# EasyEDA schematic 4 HF Upconverter (SMD)_ Power circuit.json
TITLE: HF Upconverter (SMD): Power circuit; REV: 8.14.EE; Date: 2018-03-02; Sheet: 1/1; Drawn By: IgrikXD
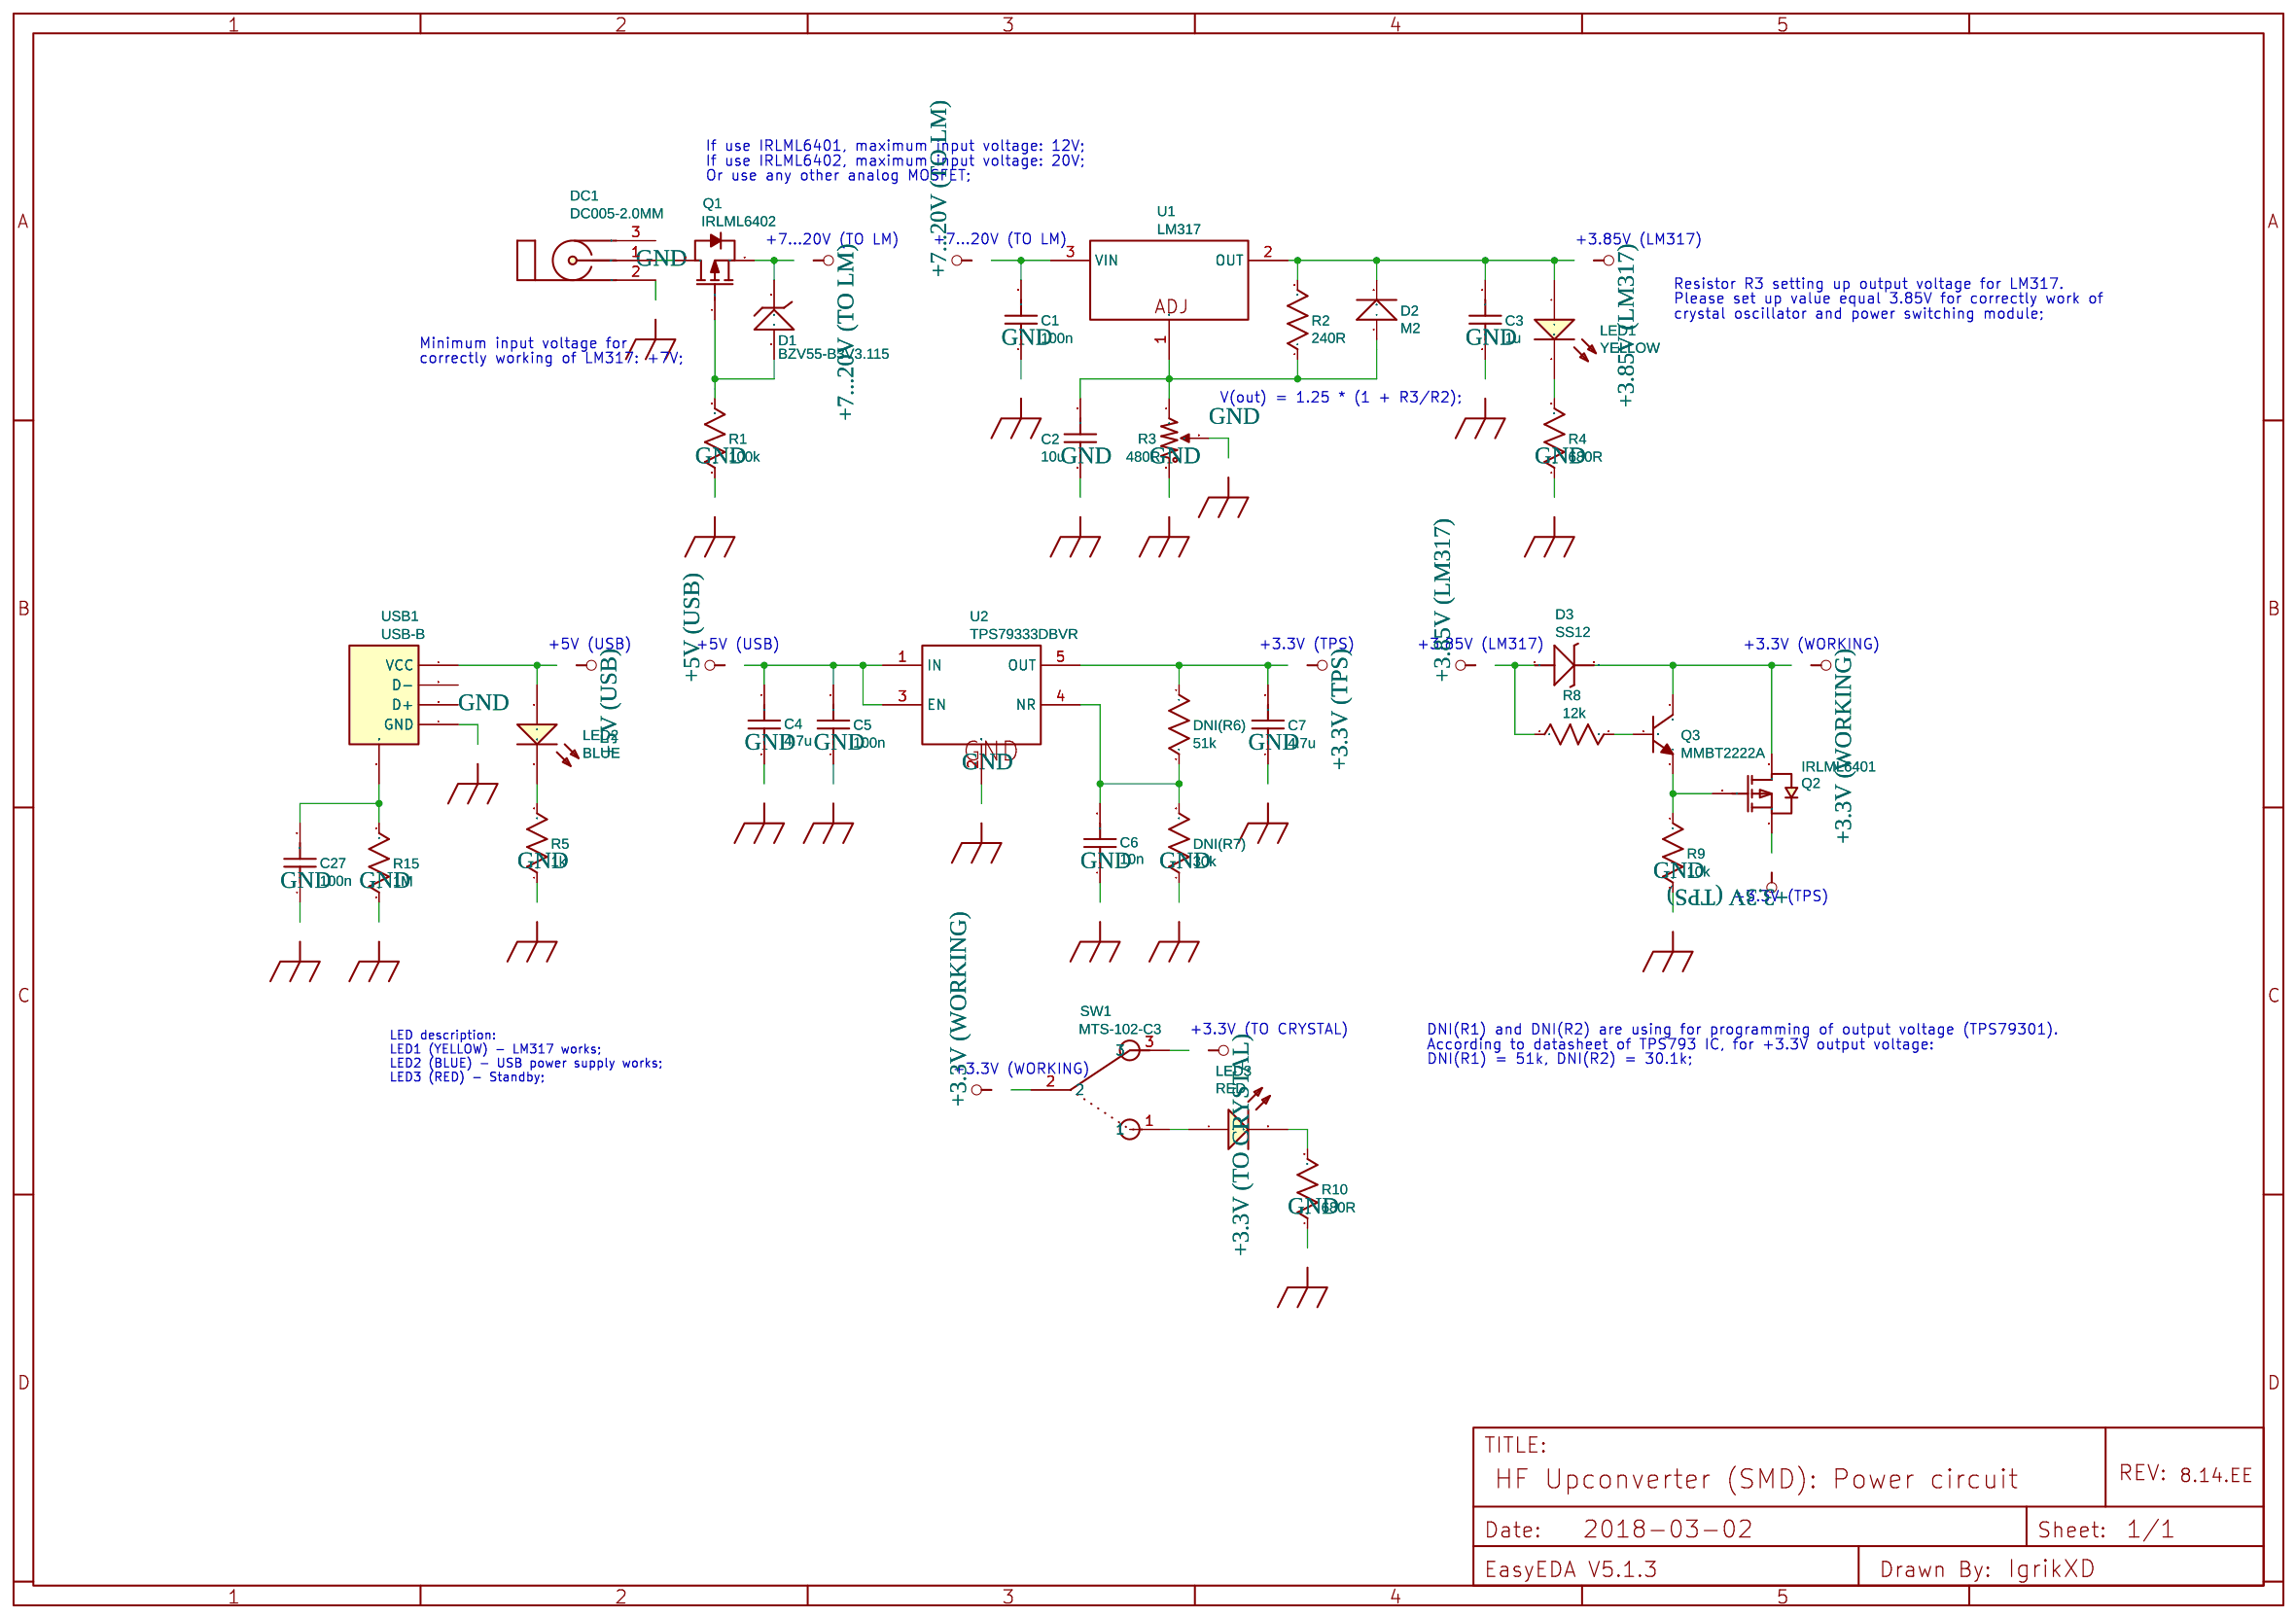
[diagram p0: schematic sheet]

## Parts
C1  100n  [0805]
C2  10u  [0805]
C3  1u  [0805]
C4  4.7u  [0805]
C5  100n  [0805]
C6  10n  [0805]
C7  4.7u  [0805]
C27  100n  [0805]
D1  BZV55-B3V3.115  [DO-213AC]
D2  M2  [DO214AC]
D3  SS12  [DO214AC]
DC1  DC005-2.0MM  [DC-5020]
DNI(R6)  51k  [0805]
DNI(R7)  30k  [0805]
LED1  YELLOW  [LED-0805]
LED2  BLUE  [LED-0805]
LED3  RED  [LED-0805]
Q1  IRLML6402  [SOT-23(SOT-23-3)]
Q2  IRLML6401  [SOT-23(SOT-23-3)]
Q3  MMBT2222A  [SOT-23(SOT-23-3)]
R1  100k  [0805]
R2  240R  [0805]
R3  480R  [RES-ADJ_3296W]
R4  680R  [0805]
R5  1k  [0805]
R8  12k  [0805]
R9  10k  [0805]
R10  680R  [0805]
R15  1M  [0805]
SW1  MTS-102-C3  [MTS-102-C3]
U1  LM317  [TO-252-2]
U2  TPS79333DBVR  [SOT23-5]
USB1  USB-B  [USB TYPE B]

## Library data of the parts
C1 C5 C27 = Capacitor: Manufacturer Part: 08055C104JAT2A; Supplier: LCSC; LCSC: C129175; Manufacturer: AVX
C2 = Capacitor: Manufacturer Part: GRM21BR71A106KE51L; Supplier: LCSC; LCSC: C86038; Manufacturer: MuRata
C3 = Capacitor: Manufacturer Part: CL21B105KAFNFNE; Supplier: LCSC; LCSC: C1712; Manufacturer: SAMSUNG
C4 C7 = Capacitor: Manufacturer Part: 0805X475K250NT; Supplier: LCSC; LCSC: C67142; Manufacturer: FH
C6 = Capacitor: Manufacturer Part: 0805CG103J500NT; Supplier: LCSC; LCSC: C63849; Manufacturer: FH
D1 = -: catid: 20; Manufacturer Part: BZV55-C3V3,115; Supplier: LCSC; LCSC: C128828; Manufacturer: Nexperia
D2 = -: catid: 20; Manufacturer Part: M2 GPP; Supplier: LCSC; LCSC: C123826; Manufacturer: MDD
D3 = -: catid: 20; Contributor: SparkFun; Manufacturer Part: SS12-LTP; Supplier: LCSC; LCSC: C85684; Manufacturer: MCC
DC1 = -: Supplier: LCSC; Manufacturer: BOOMELE; Manufacturer Part: DC-005 5.5-2.0MM; LCSC: C16214
DNI(R6) = Resistor: Manufacturer Part: RTT055102FTP; Supplier: LCSC; LCSC: C104376; Manufacturer: RALEC
DNI(R7) = Resistor: Manufacturer Part: RTT053002FTP; Supplier: LCSC; LCSC: C104202; Manufacturer: RALEC
LED1 = -: Supplier: LCSC; Manufacturer: EVERLIGHT; Manufacturer Part: 17-215UYC/S530-A3/TR8; LCSC: C72036
LED2 = -: Supplier: LCSC; Manufacturer: EVERLIGHT; Manufacturer Part: 17-21/BHC-AP1Q2/3T; LCSC: C99870
LED3 = -: Supplier: LCSC; Manufacturer: EVERLIGHT; Manufacturer Part: 17-215/R6C-AQ1R2B/3T; LCSC: C86865
Q1 = -: Supplier: LCSC; Manufacturer: IR; Manufacturer Part: IRLML6402TRPBF; LCSC: C2593
Q2 = -: Supplier: LCSC; Manufacturer: IR; Manufacturer Part: IRLML6401TRPBF; LCSC: C3034
Q3 = -: LCSC: C171740; Supplier: LCSC; Manufacturer: SK
R1 = Resistor: Manufacturer Part: RC0805FR-07100KL; Supplier: LCSC; LCSC: C96346; Manufacturer: YAGEO
R2 = Resistor: Manufacturer Part: CR0805F82400G; Supplier: LCSC; Manufacturer: LIZ; LCSC: C101586
R3 = Potentiometer: K(%): 50; Manufacturer Part: 3296W-1-102LF; Supplier: LCSC; LCSC: C57089; Manufacturer: BOURNS
R4 = Resistor: Manufacturer Part: RC0805FR-07680RL; Manufacturer: YAGEO; Supplier: LCSC; LCSC: C114549
R5 = Resistor: Manufacturer Part: RTT051001FTP; Supplier: LCSC; LCSC: C103903; Manufacturer: RALEC
R8 = Resistor: Manufacturer Part: RC0805FR-0712KL; Supplier: LCSC; LCSC: C114556; Manufacturer: YAGEO
R9 = Resistor: Manufacturer Part: CR0805F81002G; Supplier: LCSC; Manufacturer: LIZ; LCSC: C101405
R10 = Resistor: Manufacturer Part: RC0805FR-07680RL; Supplier: LCSC; Manufacturer: YAGEO; LCSC: C114549
R15 = Resistor: Manufacturer Part: RC0805FR-071ML; Supplier: LCSC; LCSC: C107700; Manufacturer: YAGEO
SW1 = -: Contributor: snhunter; sourceId: LjTecMmIi
U1 = -: Supplier: LCSC; Manufacturer: UTC; Manufacturer Part: LM317AG-TN3-R; LCSC: C75510
U2 = -: Single Output High PSRR LDO, 200 mA, Fixed 3.3 V Output, 2.7 to 5.5 V Input, 5-pin SOT-23 (DBV), -40 to 85 degC, Green (RoHS  no SbBr); catid: 20; Supplier: LCSC; LCSC: C9840; Manufacturer: TI
USB1 = -: Supplier: LCSC; Manufacturer: LCSC; Manufacturer Part: USB BFemale90 White plastic; LCSC: C46393

## Nets
+3.3V (TO CRYSTAL): SW1.3
+3.3V (TPS): C7.2 DNI(R6).1 Q2.2(S) U2.5(OUT)
+3.3V (WORKING): D3.2(C) Q2.3(D) Q3.3(C) SW1.2
+3.85V (LM317): C3.2 D2.2(C) D3.1(A) LED1.1(A) R2.2 R8.1 U1.2(OUT)
+5V (USB): C4.1 C5.2 LED2.1(A) U2.1(IN) U2.3(EN) USB1.1(VCC)
GND: C1.1 C2.1 C3.1 C4.2 C5.1 C6.1 C7.1 C27.1 DC1.2 DNI(R7).1 R1.1 R3.2(3) R3.3(2) R4.1 R5.1 R9.1 R10.1 R15.1 U2.2(GND) USB1.4(GND)
+7...20V (TO LM): C1.2 D1.2(C) Q1.2(S) U1.3(VIN)
Net-(C2-2): C2.2 D2.1(A) R2.1 R3.1 U1.1(ADJ)
Net-(C6-2): C6.2 DNI(R6).2 DNI(R7).2 U2.4(NR)
Net-(C27-2): C27.2 R15.2 USB1.5(CASE)
Net-(D1-1): D1.1(A) Q1.1(G) R1.2
Net-(DC1-1): DC1.1(VCC) Q1.3(D)
Net-(LED1-2): LED1.2(C) R4.2
Net-(LED2-2): LED2.2(C) R5.2
Net-(LED3-1): LED3.1(A) SW1.1
Net-(LED3-2): LED3.2(C) R10.2
Net-(Q2-1): Q2.1(G) Q3.2(E) R9.2
Net-(Q3-1): Q3.1(B) R8.2

Not connected (* = marked no-connect by the designer): DC1 3; USB1 2(D-) 3(D+)

## Notes on the sheet
- If use IRLML6401, maximum input voltage: 12V;
- If use IRLML6402, maximum input voltage: 20V;
- Or use any other analog MOSFET;
- +7...20V (TO LM)
- +7...20V (TO LM)
- +3.85V (LM317)
- Resistor R3 setting up output voltage for LM317.
- Please set up value equal 3.85V for correctly work of
- crystal oscillator and power switching module;
- Minimum input voltage for
- correctly working of LM317: +7V;
- V(out) = 1.25 * (1 + R3/R2);
- +5V (USB)
- +5V (USB)
- +3.3V (TPS)
- +3.85V (LM317)
- +3.3V (WORKING)
- +3.3V (TPS)
- +3.3V (TO CRYSTAL)
- DNI(R1) and DNI(R2) are using for programming of output voltage (TPS79301).
- LED description:
  LED1 (YELLOW) - LM317 works;
  LED2 (BLUE) - USB power supply works;
  LED3 (RED) - Standby;
- According to datasheet of TPS793 IC, for +3.3V output voltage:
- +3.3V (WORKING)
- DNI(R1) = 51k, DNI(R2) = 30.1k;
